# EAGLE design my_flow_pcb (EAGLE 7.1.0)
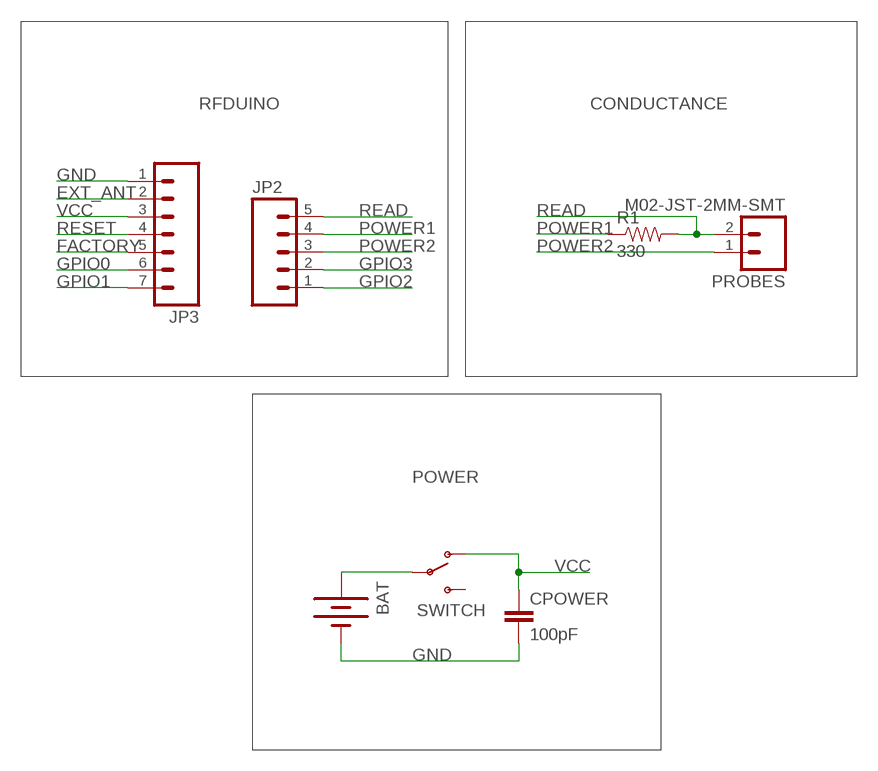
[diagram p0: schematic, sheet 1]

## Parts
BAT  BATTERY12MM  [BATTCON_12MM]
CPOWER  100pF  CAP0805  [0805]
JP2  M05PTH  [1X05]
JP3  M07  [1X07]
PROBES  M02-JST-2MM-SMT  [JST-2-SMD]
R1  330  RESISTOR0805-RES  [0805]
SWITCH  SWITCH-SPDT-SMD-A  [SWITCH-SPST-SMD-A]

## Nets
BAT+: BAT.PWR@1(+) SWITCH.2(P)
EXT_ANT: JP3.2
FACTORY: JP3.5
GND: BAT.GND(-) CPOWER.2 JP3.1
GPIO0: JP3.6
GPIO1: JP3.7
GPIO2: JP2.1
GPIO3: JP2.2
POWER1: JP2.4 R1.1
POWER2: JP2.3 PROBES.1
READ: JP2.5 PROBES.2 R1.2
RESET: JP3.4
VCC: CPOWER.1 JP3.3 SWITCH.1(O)
Unconnected: SWITCH.3(S)

## Notes on the sheet
- RFDUINO | CONDUCTANCE
- POWER

## Library data of the parts
BAT = SparkFun-Electromechanical:BATTERY: Battery Holders Various common sizes : AA, AAA, 20mm coin cell and 12mm coin cell. 20MM_4LEGS, BATT-10373; PROD_ID: BATT-08044
CPOWER = SparkFun-Passives:CAP: Capacitor Standard 0603 ceramic capacitor, and 0.1" leaded capacitor.
JP2 = SparkFun-Connectors:M05: Header 5 Standard 5-pin 0.1" header. Use with straight break away headers (SKU : PRT-00116), right angle break away headers (PRT-00553), swiss pins (PRT-00743), machine pins (PRT-00117), and female headers (PRT-00115). Molex polarized connector foot print use with SKU : PRT-08230 with associated crimp pins and housings.
JP3 = SparkFun-Connectors:M07: Header 7 Standard 7-pin 0.1" header. Use with straight break away headers (SKU : PRT-00116), right angle break away headers (PRT-00553), swiss pins (PRT-00743), machine pins (PRT-00117), and female headers (PRT-00115). NOTES ON THE VARIANTS LOCK and LOCK_LONGPADS... This footprint was designed to help hold the alignment of a through-hole component (i.e. 7-pin header) while soldering it into place. You may notice that each hole has been shifted either up or down by 0.005 of an inch from it's more standard position (which is usually a perfectly straight line). This slight alteration caused the pins (the squares in the middle) to touch the edges of the holes. Because they are alternating, it causes a "brace" to hold the header in place. 0.005 has proven to be the perfect amount of "off-center" position when using our standard breakaway headers. Although looks a little odd when you look at the bare footprint, once you have a header in there, the alteration is very hard to notice. Also, if you push a header all the way into place, it is covered up entirely on the bottom side. This idea of altering the position of holes to aid alignment will be further integrated into the Sparkfun Library for other footprints. It can help hold any component with 3 or more connection pins.
PROBES = SparkFun-Connectors:M02: Standard 2-pin 0.1" header. Use with - straight break away headers ( PRT-00116) - right angle break away headers (PRT-00553) - swiss pins (PRT-00743) - machine pins (PRT-00117) - female headers (PRT-00115) Molex polarized connector foot print use with: PRT-08233 with associated crimp pins and housings. 2.54_SCREWTERM for use with PRT-10571. 3.5mm Screw Terminal footprints for PRT-08084 5mm Screw Terminal footprints for use with PRT-08432; PROD_ID: CONN-08352
R1 = SparkFun-Resistors:RESISTOR: Resistor Basic schematic elements and footprints for 0603, 1206, and PTH resistors.
SWITCH = SparkFun-Electromechanical:SWITCH-SPDT: SPDT Switch Simple slide switch, Spark Fun Electronics SKU : COM-00102 DPDT SMT slide switch, AYZ0202, SWCH-08179

## Board
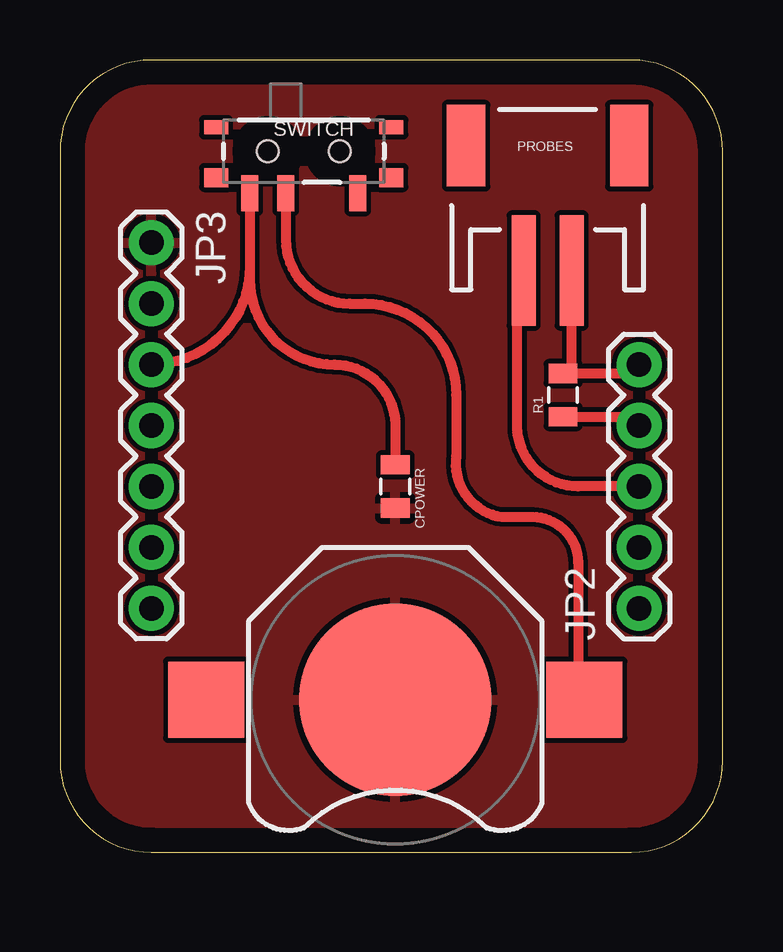
[diagram p1: board, top side]

Size 27.61 x 33.01 mm. Coordinates in mm from the lower left corner, seen from the top.
Outline: 0,29.2 0,3.81 arc90 3.81,0 23.8,0 arc90 27.61,3.81 27.61,29.2 arc90 23.8,33.01 3.81,33.01 arc90 0,29.2
Copper layers (1*16): Top 0.035mm / dielectric 1.5mm / Bottom 0.035mm
Design rules "default": minimum track width 10mil, minimum drill 24mil, track to track 8mil, track to pad 8mil, pad to pad 8mil, via to via 8mil, smd to smd 8mil, copper to edge 40mil, drill to drill 8mil, minimum pad ring 10mil, minimum via ring 8mil, stop-mask expansion 4mil, vias tented up to drill 0mil, thermal gap 10mil

### Footprints (pad centres in the part's own frame; a part is rotated, then mirrored left to right if it is on the bottom)
BATTCON_12MM = smd 8 x 8: GND 0,0 | smd 3.175 x 3.175: PWR@1 -7.874,0; PWR@2 7.874,0
0805 = smd 0.8 x 1.2: 1 -0.9,0; 2 0.9,0
1X05 = drill 1.016 pad 1.88: 1 0,0; 2 2.54,0; 3 5.08,0; 4 7.62,0; 5 10.16,0
1X07 = drill 1.016 pad 1.88: 1 0,0; 2 2.54,0; 3 5.08,0; 4 7.62,0; 5 10.16,0; 6 12.7,0; 7 15.24,0
JST-2-SMD = smd 1 x 4.6: 1 -1,-3.7; 2 1,-3.7 | smd 1.6 x 3.4: NC1 -3.4,1.5; NC2 3.4,1.5
SWITCH-SPST-SMD-A = smd 0.7 x 1.5: 1 -2.25,-1.75; 2 -0.75,-1.75; 3 2.25,-1.75 | smd 1 x 0.6: GND1 -3.65,1; GND3 3.65,1 | smd 1 x 0.8: GND2 -3.65,-1.1; GND4 3.65,-1.1 | hole 0.9: -1.5,0; 1.5,0

### Placement (x,y rotation side)
BAT  13.97,6.35 180 top
CPOWER  13.97,15.24 270 top
JP2  24.13,10.16 90 top
JP3  3.81,25.4 270 top
PROBES  20.32,27.94 0 top
R1  20.96,19.05 90 top
SWITCH  10.16,29.21 0 top

### Tracks (layer width: path | path; a pad name or v marks a point on that pad's centre or on a via)
BAT+
  Top 0.406: 21.59,6.6 arc90 BAT.PWR@1 arc-90 21.59,6.6 | 21.59,6.6 21.59,12.06 arc90 19.68,13.97 18.41,13.97 arc-90 16.51,16.51 16.51,19.05 arc90 12.7,22.86 12.07,22.86 arc-90 9.41,25.51 SWITCH.2
GND
  pour Top: -5.08,35.56 33.02,35.56 33.02,-2.54 -5.08,-2.54
POWER1
  Top 0.406: 23.71,18.2 arc-90 JP2.4 24.13,18.15 R1.1
POWER2
  Top 0.406: JP2.3 21.59,15.24 arc-90 19.05,17.78 19.05,23.97 arc-90 PROBES.1
READ
  Top 0.406: 23.71,19.9 arc90 JP2.5 24.13,19.95 R1.2 21.32,19.95 PROBES.2
VCC
  Top 0.406: SWITCH.1 7.91,24.42 | 7.91,24.42 arc-90 JP3.3 | 7.91,24.42 7.91,23.84 arc90 11.43,20.32 arc-90 13.97,17.78 CPOWER.1